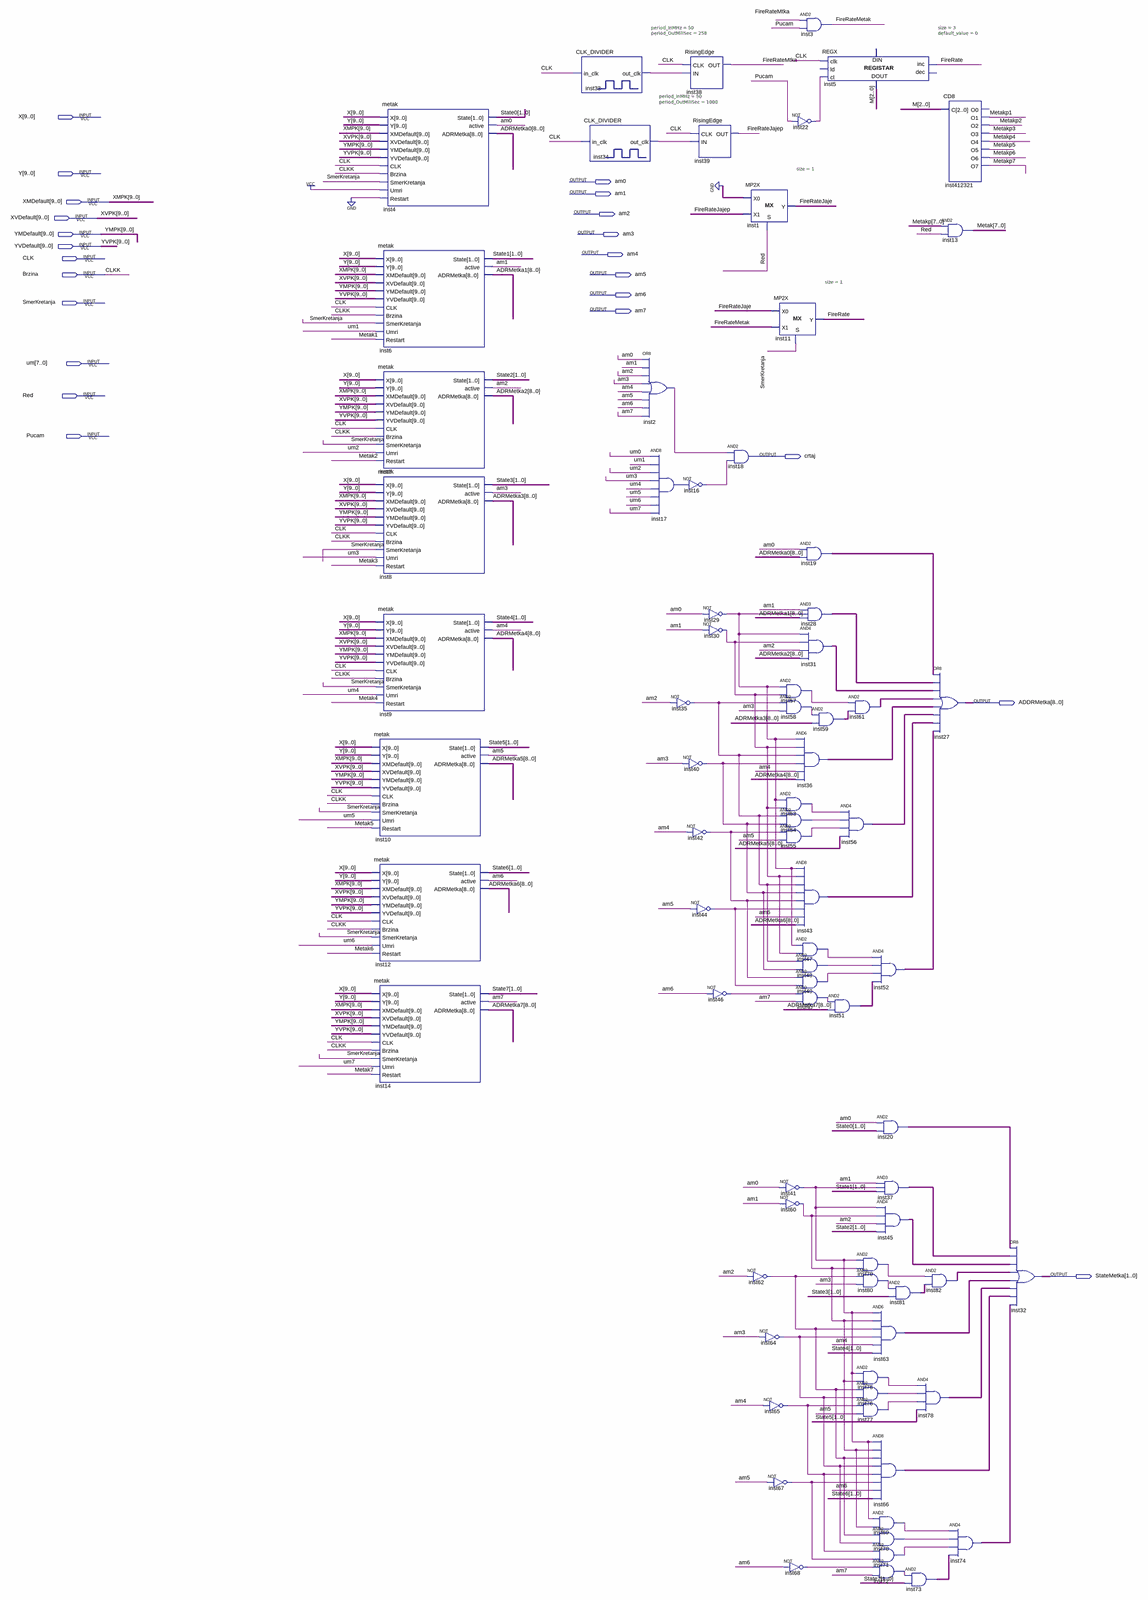
[diagram p0: schematic sheet, whole]
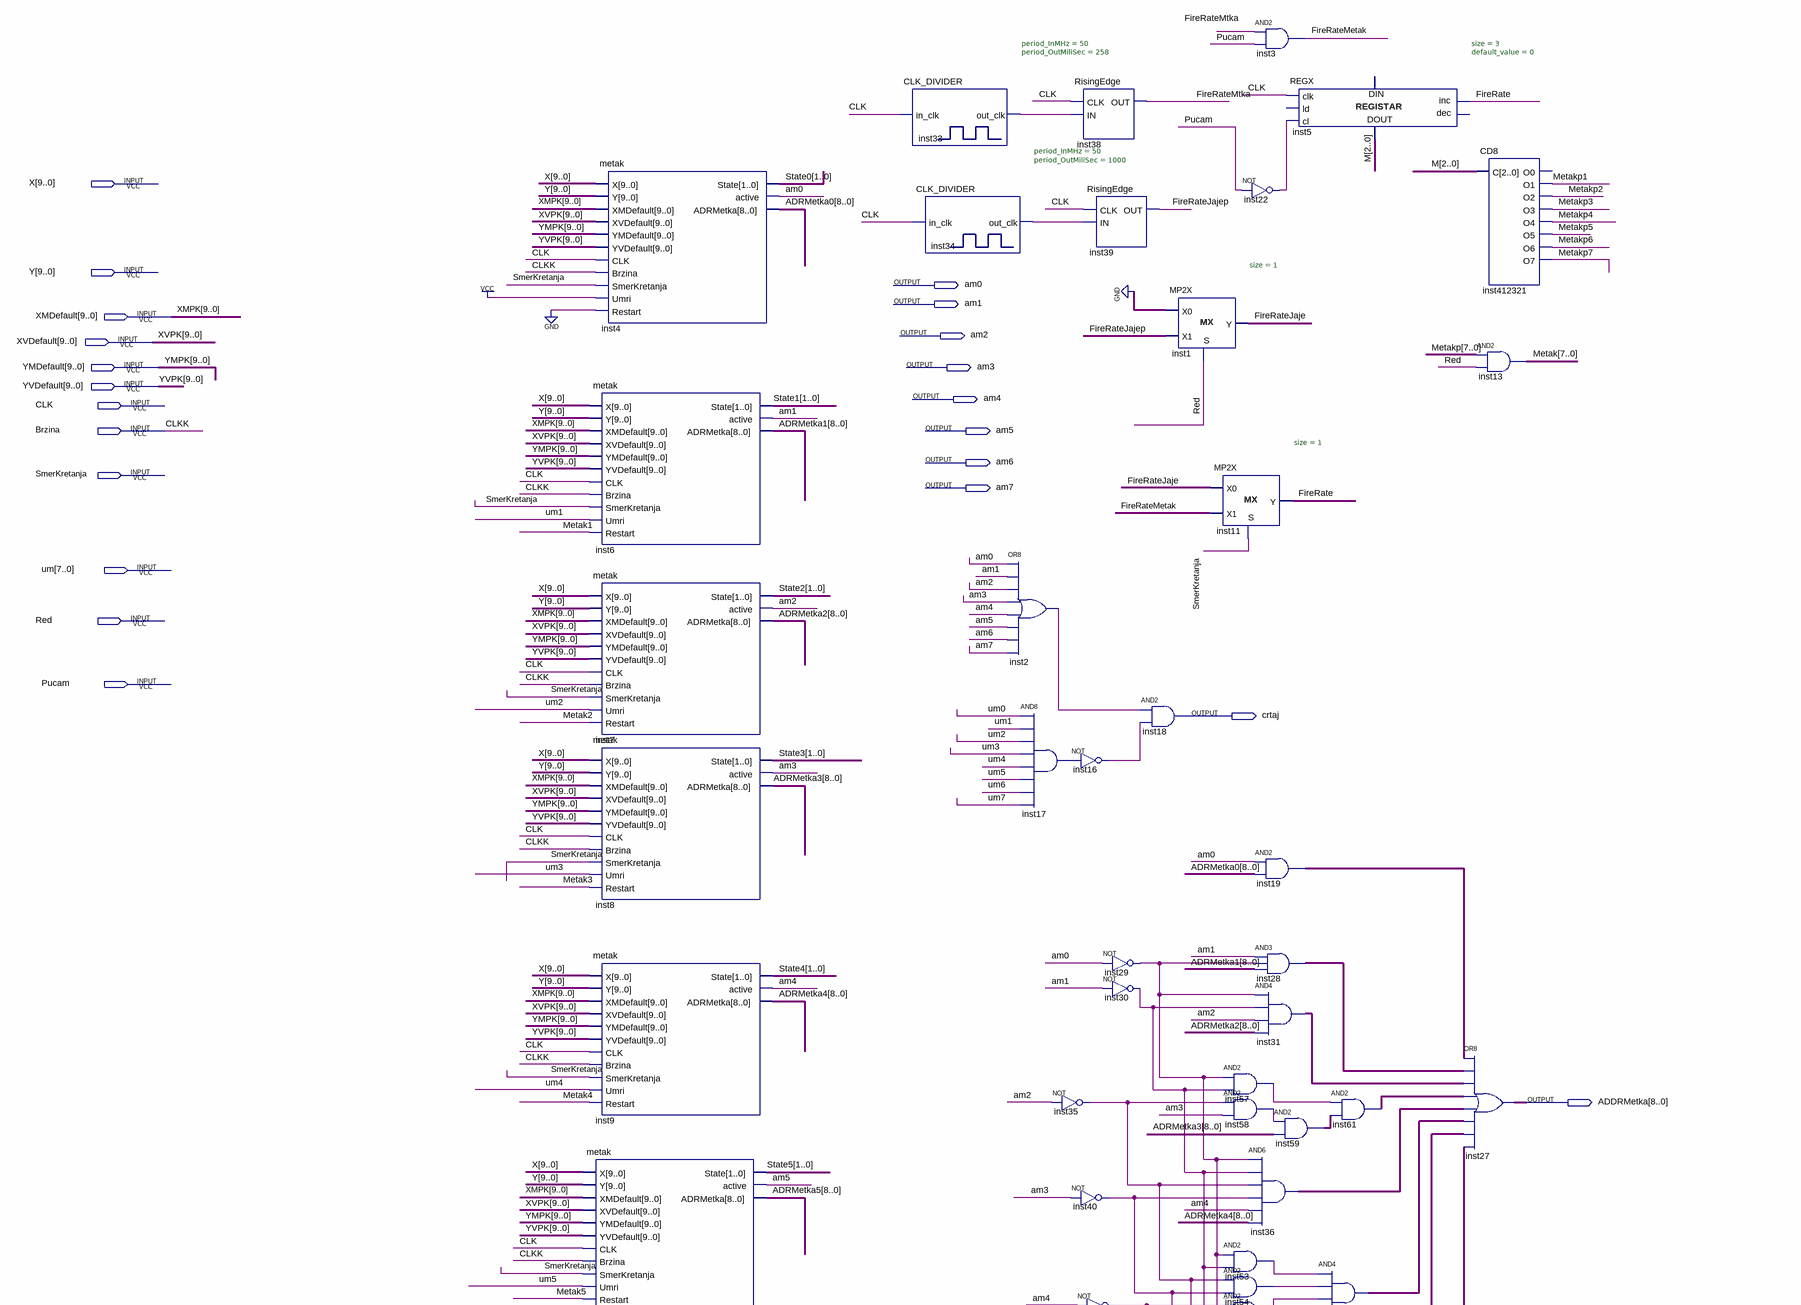
[diagram p1: schematic sheet, upper part]
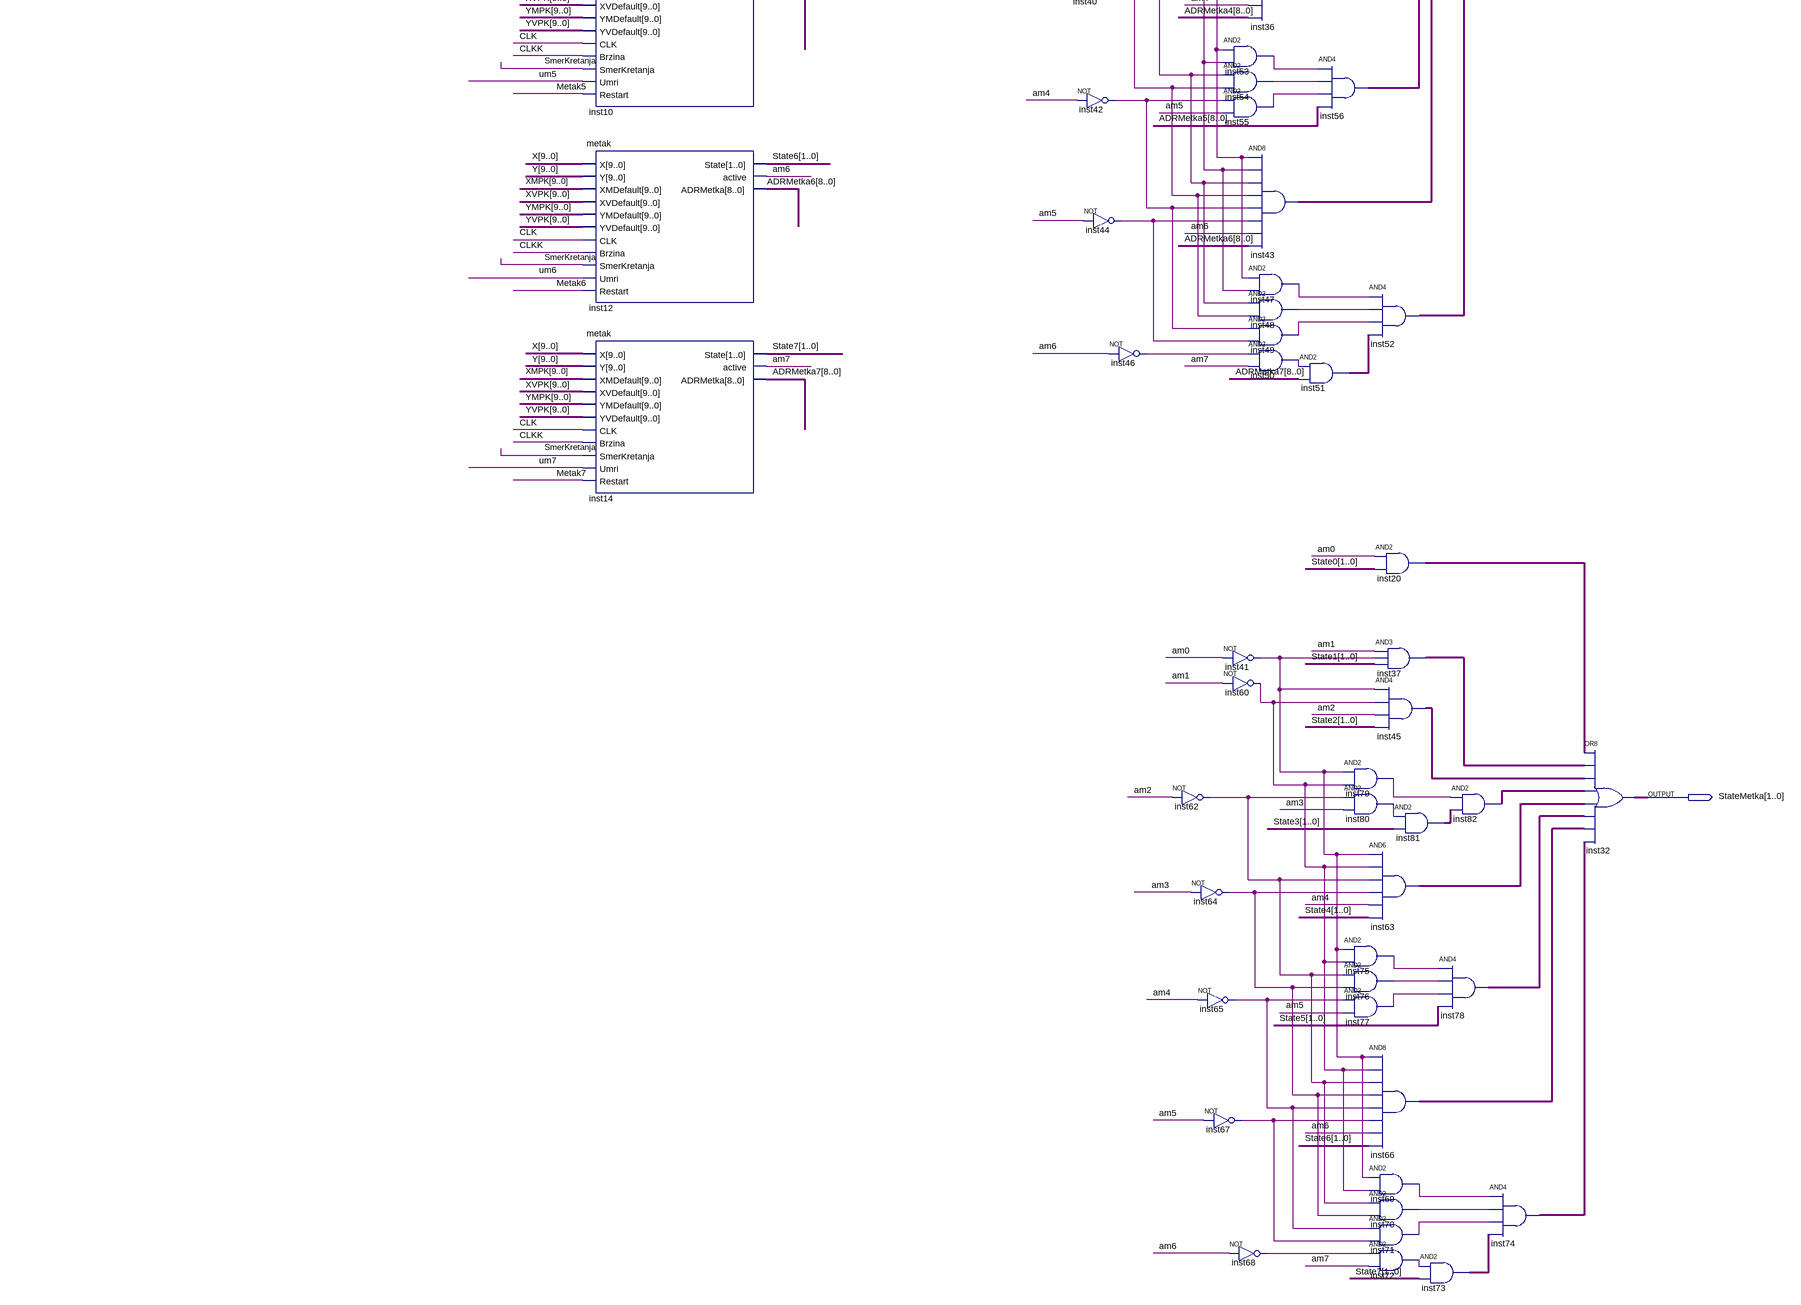
[diagram p2: schematic sheet, lower part]
// Quartus schematic Metkovi.bdf as structural Verilog: 77 symbols, 23 pins
module Metkovi (
  input  [9:0] X,
  input  [9:0] Y,
  input  [9:0] XMDefault,
  input  [9:0] XVDefault,
  input  [9:0] YMDefault,
  input  [9:0] YVDefault,
  input  CLK,
  input  Brzina,
  input  SmerKretanja,
  input  [7:0] um,
  input  Red,
  input  Pucam,
  output am0,
  output am1,
  output am2,
  output am3,
  output am4,
  output am5,
  output am6,
  output am7,
  output crtaj,
  output [8:0] ADDRMetka,
  output [1:0] StateMetka
);

  wire FireRate, FireRateJaje, FireRateJajep, FireRateMetak, FireRateMtka, inst2_out, inst16_out, inst17_out,
       inst22_out, inst29_out, inst30_out, inst33_out_clk, inst34_out_clk, inst35_out, inst40_out,
       inst41_out, inst42_out, inst44_out, inst46_out, inst47_out, inst48_out, inst49_out, inst50_out,
       inst53_out, inst54_out, inst55_out, inst57_out, inst58_out, inst60_out, inst62_out, inst64_out,
       inst65_out, inst67_out, inst68_out, inst69_out, inst70_out, inst71_out, inst72_out, inst75_out,
       inst76_out, inst77_out, inst79_out, inst80_out;
  wire [1:0] inst20_out, inst37_out, inst45_out, inst63_out, inst66_out, inst73_out, inst74_out, inst78_out,
       inst81_out, inst82_out, State0, State1, State2, State3, State4, State5, State6, State7;
  wire [2:0] M;
  wire [7:0] Metak, Metakp;
  wire [8:0] ADRMetka0, ADRMetka1, ADRMetka2, ADRMetka3, ADRMetka4, ADRMetka5, ADRMetka6, ADRMetka7,
       inst19_out, inst28_out, inst31_out, inst36_out, inst43_out, inst51_out, inst52_out, inst56_out,
       inst59_out, inst61_out;

  metak inst10 (
    .X(X), .Y(Y), .XMDefault(XMDefault), .XVDefault(XVDefault), .YMDefault(YMDefault), .YVDefault(YVDefault),
    .CLK(CLK), .Brzina(Brzina), .SmerKretanja(SmerKretanja), .Umri(um[5]), .Restart(Metak[5]),
    .State(State5), .active(am5), .ADRMetka(ADRMetka5));
  metak inst12 (
    .X(X), .Y(Y), .XMDefault(XMDefault), .XVDefault(XVDefault), .YMDefault(YMDefault), .YVDefault(YVDefault),
    .CLK(CLK), .Brzina(Brzina), .SmerKretanja(SmerKretanja), .Umri(um[6]), .Restart(Metak[6]),
    .State(State6), .active(am6), .ADRMetka(ADRMetka6));
  metak inst14 (
    .X(X), .Y(Y), .XMDefault(XMDefault), .XVDefault(XVDefault), .YMDefault(YMDefault), .YVDefault(YVDefault),
    .CLK(CLK), .Brzina(Brzina), .SmerKretanja(SmerKretanja), .Umri(um[7]), .Restart(Metak[7]),
    .State(State7), .active(am7), .ADRMetka(ADRMetka7));
  metak inst4 (
    .X(X), .Y(Y), .XMDefault(XMDefault), .XVDefault(XVDefault), .YMDefault(YMDefault), .YVDefault(YVDefault),
    .CLK(CLK), .Brzina(Brzina), .SmerKretanja(SmerKretanja), .Umri(1'b1), .Restart(1'b0), .State(State0),
    .active(am0), .ADRMetka(ADRMetka0));
  metak inst6 (
    .X(X), .Y(Y), .XMDefault(XMDefault), .XVDefault(XVDefault), .YMDefault(YMDefault), .YVDefault(YVDefault),
    .CLK(CLK), .Brzina(Brzina), .SmerKretanja(SmerKretanja), .Umri(um[1]), .Restart(Metak[1]),
    .State(State1), .active(am1), .ADRMetka(ADRMetka1));
  metak inst7 (
    .X(X), .Y(Y), .XMDefault(XMDefault), .XVDefault(XVDefault), .YMDefault(YMDefault), .YVDefault(YVDefault),
    .CLK(CLK), .Brzina(Brzina), .SmerKretanja(SmerKretanja), .Umri(um[2]), .Restart(Metak[2]),
    .State(State2), .active(am2), .ADRMetka(ADRMetka2));
  metak inst8 (
    .X(X), .Y(Y), .XMDefault(XMDefault), .XVDefault(XVDefault), .YMDefault(YMDefault), .YVDefault(YVDefault),
    .CLK(CLK), .Brzina(Brzina), .SmerKretanja(SmerKretanja), .Umri(um[3]), .Restart(Metak[3]),
    .State(State3), .active(am3), .ADRMetka(ADRMetka3));
  metak inst9 (
    .X(X), .Y(Y), .XMDefault(XMDefault), .XVDefault(XVDefault), .YMDefault(YMDefault), .YVDefault(YVDefault),
    .CLK(CLK), .Brzina(Brzina), .SmerKretanja(SmerKretanja), .Umri(um[4]), .Restart(Metak[4]),
    .State(State4), .active(am4), .ADRMetka(ADRMetka4));
  CLK_DIVIDER #(.period_InMHz(50), .period_OutMiliSec(258)) inst33 (.in_clk(CLK), .out_clk(inst33_out_clk));
  CLK_DIVIDER #(.period_InMHz(50), .period_OutMiliSec(1000)) inst34 (.in_clk(CLK), .out_clk(inst34_out_clk));
  or inst2 (inst2_out, am0, am1, am2, am3, am4, am5, am6, am7);
  and inst17 (inst17_out, um[0], um[1], um[2], um[3], um[4], um[5], um[6], um[7]);
  RisingEdge inst38 (.CLK(CLK), .IN(inst33_out_clk), .OUT(FireRateMtka));
  RisingEdge inst39 (.CLK(CLK), .IN(inst34_out_clk), .OUT(FireRateJajep));
  not inst16 (inst16_out, inst17_out);
  not inst35 (inst35_out, am2);
  not inst40 (inst40_out, am3);
  not inst42 (inst42_out, am4);
  not inst44 (inst44_out, am5);
  and inst18 (crtaj, inst2_out, inst16_out);
  not inst29 (inst29_out, am0);
  not inst30 (inst30_out, am1);
  not inst46 (inst46_out, am6);
  MP2X #(.size(1)) inst1 (.S(Red), .X0(1'b0), .X1(FireRateJajep), .Y(FireRateJaje));
  not inst62 (inst62_out, am2);
  not inst64 (inst64_out, am3);
  not inst22 (inst22_out, Pucam);
  MP2X #(.size(1)) inst11 (.S(SmerKretanja), .X0(FireRateJaje), .X1(FireRateMetak), .Y(FireRate));
  and inst57 (inst57_out, inst29_out, inst30_out);
  and inst58 (inst58_out, inst35_out, am3);
  and inst53 (inst53_out, inst29_out, inst30_out);
  and inst54 (inst54_out, inst35_out, inst40_out);
  and inst55 (inst55_out, inst42_out, am5);
  not inst41 (inst41_out, am0);
  not inst60 (inst60_out, am1);
  not inst65 (inst65_out, am4);
  not inst67 (inst67_out, am5);
  not inst68 (inst68_out, am6);
  and inst3 (FireRateMetak, FireRateMtka, Pucam);
  REGX #(.size(3), .default_value(0)) inst5 (
    .clk(CLK), .cl(inst22_out), .inc(FireRate), .data_out(M));  // open: ld, dec, data_in
  assign inst19_out = {9{am0}} & ADRMetka0;  // AND2 inst19, 9 bits wide
  assign inst28_out = {9{am1}} & {9{inst29_out}} & ADRMetka1;  // AND3 inst28, 9 bits wide
  assign inst31_out = {9{inst29_out}} & {9{inst30_out}} & {9{am2}} & ADRMetka2;  // AND4 inst31, 9 bits wide
  assign inst59_out = {9{inst58_out}} & ADRMetka3;  // AND2 inst59, 9 bits wide
  assign inst36_out = {9{inst29_out}} & {9{inst30_out}} & {9{inst35_out}} & {9{inst40_out}} & {9{am4}} & ADRMetka4;  // AND6 inst36, 9 bits wide
  assign inst43_out = {9{inst29_out}} & {9{inst30_out}} & {9{inst35_out}} & {9{inst40_out}} & {9{inst42_out}} & {9{inst44_out}} & {9{am6}} & ADRMetka6;  // AND8 inst43, 9 bits wide
  and inst47 (inst47_out, inst29_out, inst30_out);
  and inst48 (inst48_out, inst35_out, inst40_out);
  and inst49 (inst49_out, inst42_out, inst44_out);
  and inst50 (inst50_out, inst46_out, am7);
  assign inst61_out = {9{inst57_out}} & inst59_out;  // AND2 inst61, 9 bits wide
  assign inst56_out = {9{inst53_out}} & {9{inst54_out}} & {9{inst55_out}} & ADRMetka5;  // AND4 inst56, 9 bits wide
  assign inst51_out = {9{inst50_out}} & ADRMetka7;  // AND2 inst51, 9 bits wide
  and inst79 (inst79_out, inst41_out, inst60_out);
  and inst80 (inst80_out, inst62_out, am3);
  and inst75 (inst75_out, inst41_out, inst60_out);
  and inst76 (inst76_out, inst62_out, inst64_out);
  and inst77 (inst77_out, inst65_out, am5);
  assign inst52_out = {9{inst47_out}} & {9{inst48_out}} & {9{inst49_out}} & inst51_out;  // AND4 inst52, 9 bits wide
  assign inst20_out = {2{am0}} & State0;  // AND2 inst20, 2 bits wide
  assign inst37_out = {2{am1}} & {2{inst41_out}} & State1;  // AND3 inst37, 2 bits wide
  assign inst45_out = {2{inst41_out}} & {2{inst60_out}} & {2{am2}} & State2;  // AND4 inst45, 2 bits wide
  assign inst81_out = {2{inst80_out}} & State3;  // AND2 inst81, 2 bits wide
  assign inst63_out = {2{inst41_out}} & {2{inst60_out}} & {2{inst62_out}} & {2{inst64_out}} & {2{am4}} & State4;  // AND6 inst63, 2 bits wide
  assign inst66_out = {2{inst41_out}} & {2{inst60_out}} & {2{inst62_out}} & {2{inst64_out}} & {2{inst65_out}} & {2{inst67_out}} & {2{am6}} & State6;  // AND8 inst66, 2 bits wide
  and inst69 (inst69_out, inst41_out, inst60_out);
  and inst70 (inst70_out, inst62_out, inst64_out);
  and inst71 (inst71_out, inst65_out, inst67_out);
  and inst72 (inst72_out, inst68_out, am7);
  assign inst78_out = {2{inst75_out}} & {2{inst76_out}} & {2{inst77_out}} & State5;  // AND4 inst78, 2 bits wide
  assign inst73_out = {2{inst72_out}} & State7;  // AND2 inst73, 2 bits wide
  CD8 inst412321 (
    .C(M), .O1(Metakp[1]), .O2(Metakp[2]), .O3(Metakp[3]), .O4(Metakp[4]), .O5(Metakp[5]), .O6(Metakp[6]),
    .O7(Metakp[7]));  // open: O0
  assign Metak = Metakp & {8{Red}};  // AND2 inst13, 8 bits wide
  assign ADDRMetka = inst19_out | inst28_out | inst31_out | inst61_out | inst36_out | inst56_out | inst43_out | inst52_out;  // OR8 inst27, 9 bits wide
  assign inst82_out = {2{inst79_out}} & inst81_out;  // AND2 inst82, 2 bits wide
  assign inst74_out = {2{inst69_out}} & {2{inst70_out}} & {2{inst71_out}} & inst73_out;  // AND4 inst74, 2 bits wide
  assign StateMetka = inst20_out | inst37_out | inst45_out | inst82_out | inst63_out | inst78_out | inst66_out | inst74_out;  // OR8 inst32, 2 bits wide

  // Other names for the same wires on the sheet: CLKK = Brzina; XMPK[9:0] = XMDefault; XVPK[9:0] = XVDefault;
  //   YMPK[9:0] = YMDefault; YVPK[9:0] = YVDefault
endmodule
